# EAGLE design Connector_Exp (EAGLE 9.3.2)
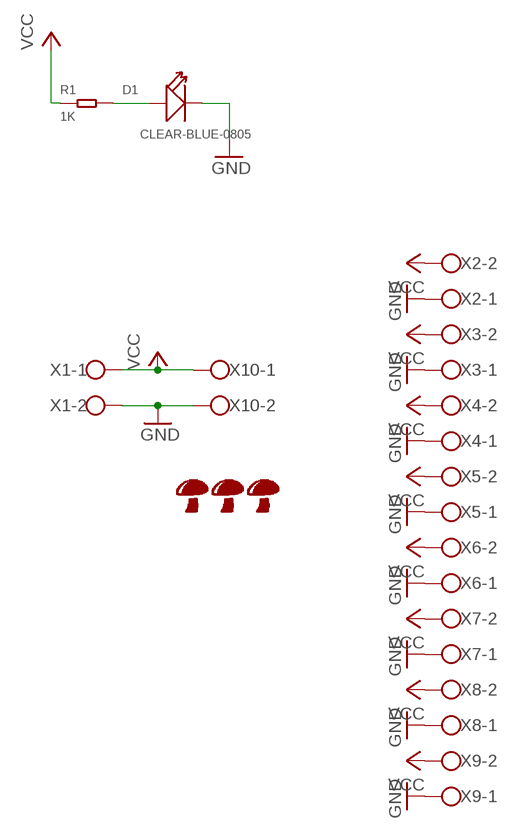
[diagram p0: schematic, sheet 1]

## Parts
D1  CLEAR-BLUE-0805  SMD-LED-CLEAR-BLUE(0805)  [LED-0805]
R1  1K  SMD-RES-1K-5%-1/8W(0805)  [R0805]
U$1  SHROOMTOPSILK  [SHROOM_TS]
U$2  SHROOMBOTTOMSILK  [SHROOM_BS]
U$3  SHROOM10MM  [SHROOM10MM]
X1  W237-102  [W237-102]
X2  W237-102  [W237-102]
X3  W237-102  [W237-102]
X4  W237-102  [W237-102]
X5  W237-102  [W237-102]
X6  W237-102  [W237-102]
X7  W237-102  [W237-102]
X8  W237-102  [W237-102]
X9  W237-102  [W237-102]
X10  W237-102  [W237-102]

## Nets
GND: D1.- X1.2 X2.1 X3.1 X4.1 X5.1 X6.1 X7.1 X8.1 X9.1 X10.2
N$2: D1.+ R1.2
VCC: R1.1 X1.1 X2.2 X3.2 X4.2 X5.2 X6.2 X7.2 X8.2 X9.2 X10.1

## Library data of the parts
D1 = OPL_Optoelectronics:SMD-LED-CLEAR-BLUE(0805): 304090061; MPN: EL-17-215/BHC-AN1P2/3T
R1 = OPL_Resistor:SMD-RES-1K-5%-1/8W(0805): 301012189; MPN: RC0805JR-071KL
U$1-U$3 = RobThePyro:SHROOM
X1-X10 = con-wago-500:W237-102: WAGO SCREW CLAMP; MPN: 237-102; OC_FARNELL: unknown; OC_NEWARK: 70K9898

## Board
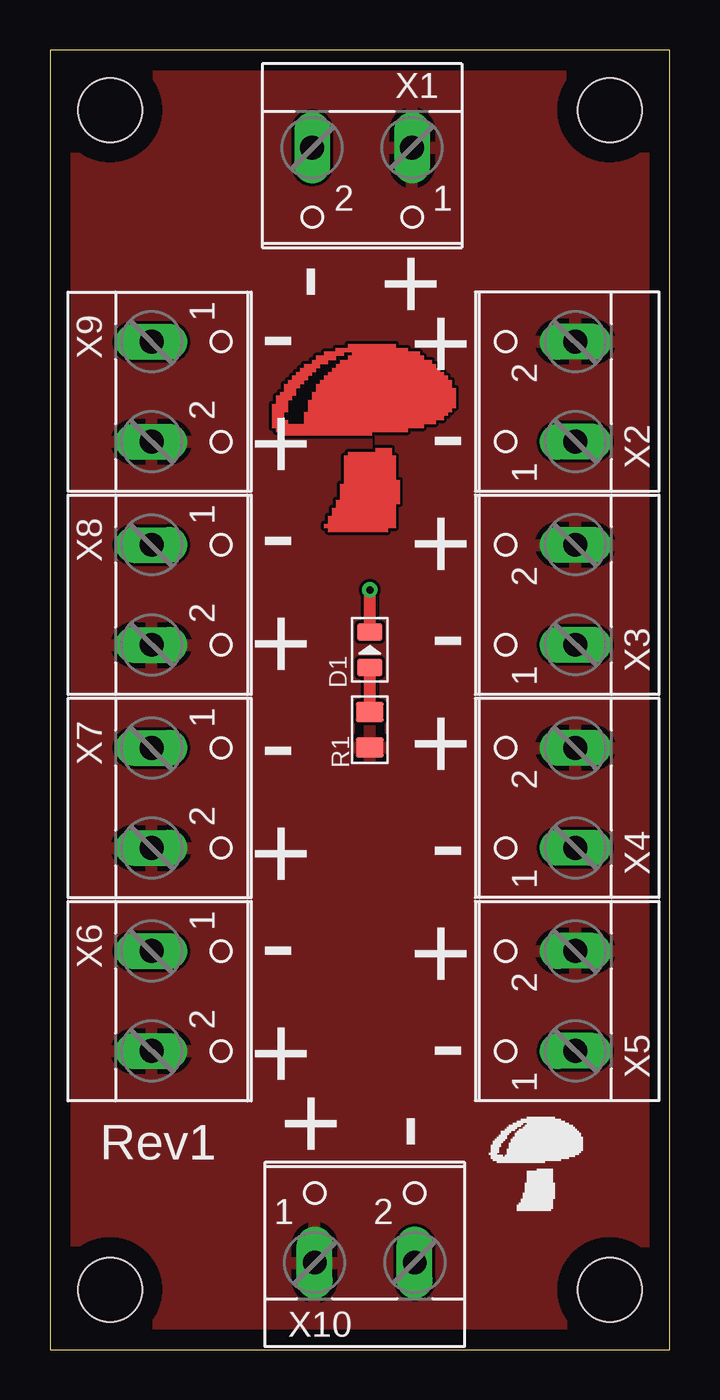
[diagram p1: board, top side]
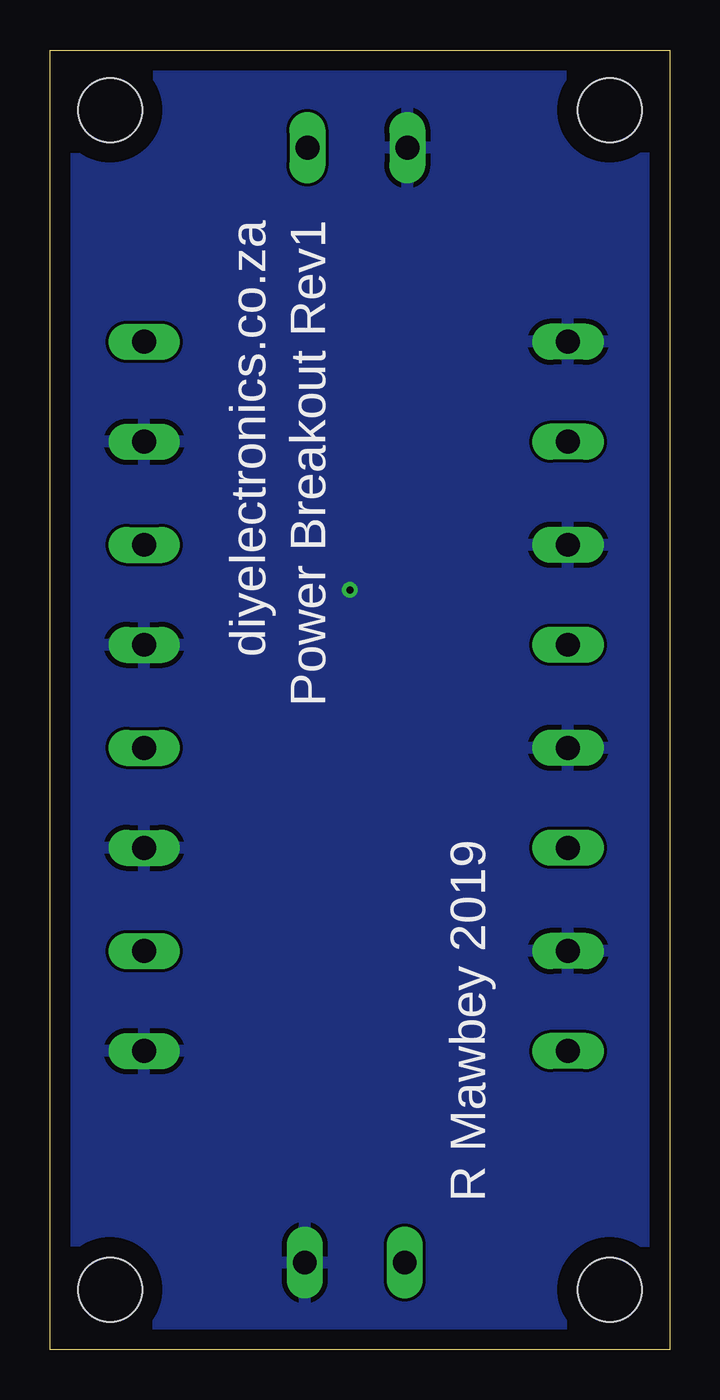
[diagram p2: board, bottom side, seen from below]

Size 31 x 65 mm. Coordinates in mm from the lower left corner, seen from the top.
Outline: 0,0 31,0 31,65 0,65 0,0
Copper layers (1*16): Top 0.035mm / dielectric 1.5mm / Bottom 0.035mm
Design rules "default": minimum track width 6mil, minimum drill 0.35mm, track to track 6mil, track to pad 6mil, pad to pad 6mil, via to via 6mil, smd to smd 6mil, copper to edge 40mil, drill to drill 6mil, minimum pad ring 10mil, minimum via ring 8mil, stop-mask expansion 4mil, vias tented up to drill 0mil, thermal gap 10mil
Holes 3.2 mm at 3,3 28,3 28,62 3,62

### Footprints (pad centres in the part's own frame; a part is rotated, then mirrored left to right if it is on the bottom)
LED-0805 = smd 0.889 x 1.27: + -0.889,0; - 0.889,0
R0805 = smd 1.397 x 1.016: 1 0,0.889; 2 0,-0.889
W237-102 = drill 1.194 long: 1 -2.5,-1.27; 2 2.5,-1.27

### Placement (x,y rotation side)
D1  16,35 90 top
R1  16,31 180 top
U$1  22,7 0 top
U$2  22,7 0 top
U$3  11,41 0 top
X1  15.62,58.85 180 top
X2  25.02,47.91 90 top
X3  25.02,37.75 90 top
X4  25.02,27.59 90 top
X5  25.02,17.43 90 top
X6  6.35,17.43 270 top
X7  6.35,27.59 270 top
X8  6.35,37.75 270 top
X9  6.35,47.91 270 top
X10  15.75,5.62 0 top

### Tracks (layer width: path | path; a pad name or v marks a point on that pad's centre or on a via)
GND  (via drill 0.35)
  Top 0.61: D1.- v16,38
  pour Bottom: 0,0 0,65 31,65 31,0
N$2
  Top 0.61: R1.2 D1.+
VCC
  pour Top: 0,0 0,65 31,65 31,0

### Text on the board
tNames: - | + | - | + | + | - | - | + | + | - | - | + | - | + | - | + | - | + | Rev1 | + | -
bNames: Power Breakout Rev1 | diyelectronics.co.za | R Mawbey 2019